# EAGLE design control_board (EAGLE 9.5.1)
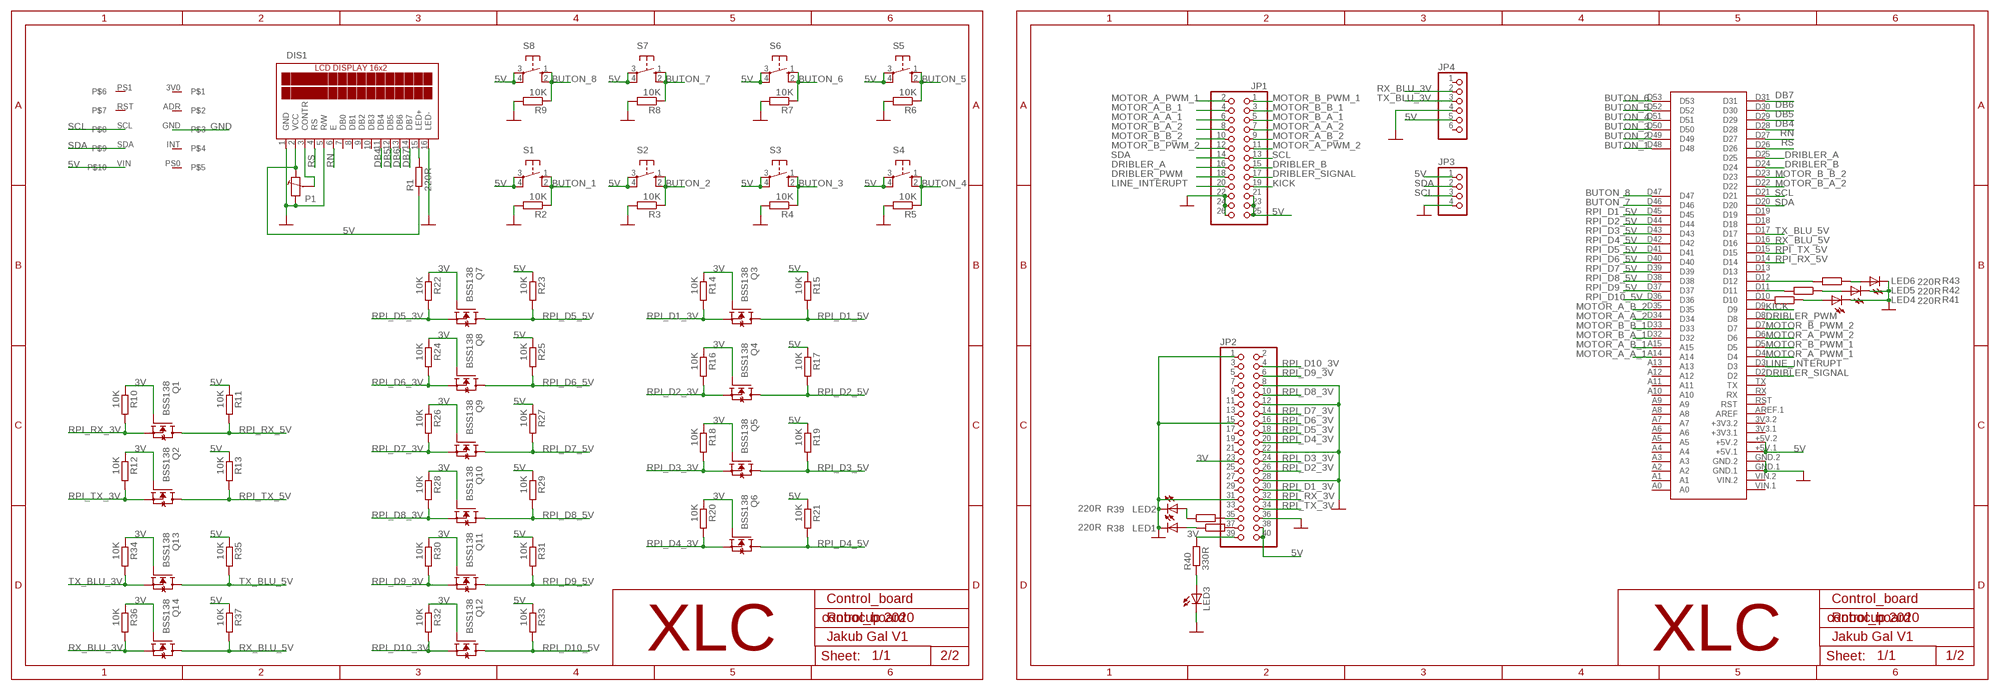
[diagram p0: schematic, sheet 1]

## Parts
DIS1  LCD_DISPLEJ_16X2Z  [LCD_DISPLEJ_16X2]
JP1  PINHD-2X13_2.54  [2X13]
JP2  PINHD-2X20_2.54  [2X20]
JP3  PINHD-1X4_2.54  [1X04]
JP4  PINHD-1X6_2.54  [1X06]
LED1  LEDCHIPLED_0603  [CHIPLED_0603]
LED2  LEDCHIPLED_0603  [CHIPLED_0603]
LED3  LEDCHIPLED_0603  [CHIPLED_0603]
LED4  LEDCHIPLED_0603  [CHIPLED_0603]
LED5  LEDCHIPLED_0603  [CHIPLED_0603]
LED6  LEDCHIPLED_0603  [CHIPLED_0603]
P1  TRIMER-CA6V  [TP-CA6V]
Q1  BSS138  [SOT23]
Q2  BSS138  [SOT23]
Q3  BSS138  [SOT23]
Q4  BSS138  [SOT23]
Q5  BSS138  [SOT23]
Q6  BSS138  [SOT23]
Q7  BSS138  [SOT23]
Q8  BSS138  [SOT23]
Q9  BSS138  [SOT23]
Q10  BSS138  [SOT23]
Q11  BSS138  [SOT23]
Q12  BSS138  [SOT23]
Q13  BSS138  [SOT23]
Q14  BSS138  [SOT23]
R1  220R  R-EU_R0603  [R0603]
R2  10K  R-EU_R0603  [R0603]
R3  10K  R-EU_R0603  [R0603]
R4  10K  R-EU_R0603  [R0603]
R5  10K  R-EU_R0603  [R0603]
R6  10K  R-EU_R0603  [R0603]
R7  10K  R-EU_R0603  [R0603]
R8  10K  R-EU_R0603  [R0603]
R9  10K  R-EU_R0603  [R0603]
R10  10K  R-EU_R0603  [R0603]
R11  10K  R-EU_R0603  [R0603]
R12  10K  R-EU_R0603  [R0603]
R13  10K  R-EU_R0603  [R0603]
R14  10K  R-EU_R0603  [R0603]
R15  10K  R-EU_R0603  [R0603]
R16  10K  R-EU_R0603  [R0603]
R17  10K  R-EU_R0603  [R0603]
R18  10K  R-EU_R0603  [R0603]
R19  10K  R-EU_R0603  [R0603]
R20  10K  R-EU_R0603  [R0603]
R21  10K  R-EU_R0603  [R0603]
R22  10K  R-EU_R0603  [R0603]
R23  10K  R-EU_R0603  [R0603]
R24  10K  R-EU_R0603  [R0603]
R25  10K  R-EU_R0603  [R0603]
R26  10K  R-EU_R0603  [R0603]
R27  10K  R-EU_R0603  [R0603]
R28  10K  R-EU_R0603  [R0603]
R29  10K  R-EU_R0603  [R0603]
R30  10K  R-EU_R0603  [R0603]
R31  10K  R-EU_R0603  [R0603]
R32  10K  R-EU_R0603  [R0603]
R33  10K  R-EU_R0603  [R0603]
R34  10K  R-EU_R0603  [R0603]
R35  10K  R-EU_R0603  [R0603]
R36  10K  R-EU_R0603  [R0603]
R37  10K  R-EU_R0603  [R0603]
R38  220R  R-EU_R0603  [R0603]
R39  220R  R-EU_R0603  [R0603]
R40  330R  R-EU_R0603  [R0603]
R41  220R  R-EU_R0603  [R0603]
R42  220R  R-EU_R0603  [R0603]
R43  220R  R-EU_R0603  [R0603]
S1  10-XX  [B3F-10XX]
S2  10-XX  [B3F-10XX]
S3  10-XX  [B3F-10XX]
S4  10-XX  [B3F-10XX]
S5  10-XX  [B3F-10XX]
S6  10-XX  [B3F-10XX]
S7  10-XX  [B3F-10XX]
S8  10-XX  [B3F-10XX]
U$1  MEGA2560_MIKRO  [MEGA2560_MIKRO]
U$2  BNO055  [BNO005]

## Nets
3V: JP2.23 JP2.39 Q1.1(G) Q2.1(G) Q3.1(G) Q4.1(G) Q5.1(G) Q6.1(G) Q7.1(G) Q8.1(G) Q9.1(G) Q10.1(G) Q11.1(G) Q12.1(G) Q13.1(G) Q14.1(G) R10.1 R12.1 R14.1 R16.1 R18.1 R20.1 R22.1 R24.1 R26.1 R28.1 R30.1 R32.1 R34.1 R36.1 R40.2
5V: DIS1.2(VCC) JP1.21 JP1.23 JP1.25 JP2.38 JP2.40 JP3.1 JP4.5 P1.2 R1.1 R11.1 R13.1 R15.1 R17.1 R19.1 R21.1 R23.1 R25.1 R27.1 R29.1 R31.1 R33.1 R35.1 R37.1 S1.3(P) S1.4(P1) S2.3(P) S2.4(P1) S3.3(P) S3.4(P1) S4.3(P) S4.4(P1) S5.3(P) S5.4(P1) S6.3(P) S6.4(P1) S7.3(P) S7.4(P1) S8.3(P) S8.4(P1) U$1.+5V.1 U$1.+5V.2 U$2.VIN
BUTON_1: R2.1 S1.1(S) S1.2(S1) U$1.D48
BUTON_2: R3.1 S2.1(S) S2.2(S1) U$1.D49
BUTON_3: R4.1 S3.1(S) S3.2(S1) U$1.D50
BUTON_4: R5.1 S4.1(S) S4.2(S1) U$1.D51
BUTON_5: R6.1 S5.1(S) S5.2(S1) U$1.D52
BUTON_6: R7.1 S6.1(S) S6.2(S1) U$1.D53
BUTON_7: R8.1 S7.1(S) S7.2(S1) U$1.D46
BUTON_8: R9.1 S8.1(S) S8.2(S1) U$1.D47
DB4: DIS1.11(DB4) U$1.D28
DB5: DIS1.12(DB5) U$1.D29
DB6: DIS1.13(DB6) U$1.D30
DB7: DIS1.14(DB7) U$1.D31
DRIBLER_A: JP1.16 U$1.D25
DRIBLER_B: JP1.15 U$1.D24
DRIBLER_PWM: JP1.18 U$1.D8
DRIBLER_SIGNAL: JP1.17 U$1.D2
GND: DIS1.1(GND) DIS1.5(R/W) DIS1.16(LED-) JP1.22 JP1.24 JP1.26 JP2.1 JP2.8 JP2.12 JP2.15 JP2.22 JP2.28 JP2.31 JP2.36 JP3.4 JP4.4 LED1.C LED2.C LED3.C LED4.C LED5.C LED6.C P1.1 R2.2 R3.2 R4.2 R5.2 R6.2 R7.2 R8.2 R9.2 U$1.GND.1 U$1.GND.2 U$2.GND
KICK: JP1.19 U$1.D9
LINE_INTERUPT: JP1.20 U$1.D3
MOTOR_A_A_1: JP1.6 U$1.A14
MOTOR_A_A_2: JP1.7 U$1.D34
MOTOR_A_B_1: JP1.4 U$1.A15
MOTOR_A_B_2: JP1.9 U$1.D35
MOTOR_A_PWM_1: JP1.2 U$1.D4
MOTOR_A_PWM_2: JP1.11 U$1.D6
MOTOR_B_A_1: JP1.5 U$1.D32
MOTOR_B_A_2: JP1.8 U$1.D22
MOTOR_B_B_1: JP1.3 U$1.D33
MOTOR_B_B_2: JP1.10 U$1.D23
MOTOR_B_PWM_1: JP1.1 U$1.D5
MOTOR_B_PWM_2: JP1.12 U$1.D7
N$1: JP2.37 R38.2
N$2: DIS1.15(LED+) R1.2
N$3: DIS1.3(CONTR) P1.BEZ
N$4: LED2.A R39.1
N$5: JP2.35 R39.2
N$6: LED3.A R40.1
N$7: LED4.A R41.1
N$8: R41.2 U$1.D10
N$9: LED5.A R42.1
N$10: R42.2 U$1.D11
N$11: LED6.A R43.1
N$12: R43.2 U$1.D12
N$20: LED1.A R38.1
RN: DIS1.6(E) U$1.D27
RPI_D1_3V: JP2.30 Q3.2(S) R14.2
RPI_D1_5V: Q3.3(D) R15.2 U$1.D45
RPI_D2_3V: JP2.26 Q4.2(S) R16.2
RPI_D2_5V: Q4.3(D) R17.2 U$1.D44
RPI_D3_3V: JP2.24 Q5.2(S) R18.2
RPI_D3_5V: Q5.3(D) R19.2 U$1.D43
RPI_D4_3V: JP2.20 Q6.2(S) R20.2
RPI_D4_5V: Q6.3(D) R21.2 U$1.D42
RPI_D5_3V: JP2.18 Q7.2(S) R22.2
RPI_D5_5V: Q7.3(D) R23.2 U$1.D41
RPI_D6_3V: JP2.16 Q8.2(S) R24.2
RPI_D6_5V: Q8.3(D) R25.2 U$1.D40
RPI_D7_3V: JP2.14 Q9.2(S) R26.2
RPI_D7_5V: Q9.3(D) R27.2 U$1.D39
RPI_D8_3V: JP2.10 Q10.2(S) R28.2
RPI_D8_5V: Q10.3(D) R29.2 U$1.D38
RPI_D9_3V: JP2.6 Q11.2(S) R30.2
RPI_D9_5V: Q11.3(D) R31.2 U$1.D37
RPI_D10_3V: JP2.4 Q12.2(S) R32.2
RPI_D10_5V: Q12.3(D) R33.2 U$1.D36
RPI_RX_3V: JP2.32 Q1.2(S) R10.2
RPI_RX_5V: Q1.3(D) R11.2 U$1.D14
RPI_TX_3V: JP2.34 Q2.2(S) R12.2
RPI_TX_5V: Q2.3(D) R13.2 U$1.D15
RS: DIS1.4(RS) U$1.D26
RX_BLU_3V: JP4.2 Q14.2(S) R36.2
RX_BLU_5V: Q14.3(D) R37.2 U$1.D16
SCL: JP1.13 JP3.3 U$1.D21 U$2.SCL
SDA: JP1.14 JP3.2 U$1.D20 U$2.SDA
TX_BLU_3V: JP4.3 Q13.2(S) R34.2
TX_BLU_5V: Q13.3(D) R35.2 U$1.D17
Unconnected: DIS1.7(DB0) DIS1.8(DB1) DIS1.9(DB2) DIS1.10(DB3) JP2.2 JP2.3 JP2.5 JP2.7 JP2.9 JP2.11 JP2.13 JP2.17 JP2.19 JP2.21 JP2.25 JP2.27 JP2.29 JP2.33 JP4.1 JP4.6 U$1.3V3.1(+3V3.1) U$1.3V3.2(+3V3.2) U$1.A0 U$1.A1 U$1.A2 U$1.A3 U$1.A4 U$1.A5 U$1.A6 U$1.A7 U$1.A8 U$1.A9 U$1.A10 U$1.A11 U$1.A12 U$1.A13 U$1.AREF.1(AREF) U$1.D13 U$1.D18 U$1.D19 U$1.RST U$1.RX U$1.TX U$1.VIN.1 U$1.VIN.2 U$2.3V0 U$2.ADR U$2.INT U$2.PS0 U$2.PS1 U$2.RST

## Notes on the sheet
- Control_board | Control_board
- Robocup 2020 | Robocup 2020
- Jakub Gal V1 | Jakub Gal V1
- XLC | XLC
- 2/2 | 1/2

## Library data of the parts
DIS1 = TABOR K1:LCD_DISPLEJ_16X2: LCD displej 16x2 s IO HD44870 : kolik= 0,6x0,6mm diera s pokovenim = 0,9mm vrtanie = 1,1mm
JP1 = pinhead-1:PINHD-2X13: PIN HEADER
JP2 = pinhead-1:PINHD-2X20: PIN HEADER
JP3 = pinhead-1:PINHD-1X4: PIN HEADER
JP4 = pinhead-1:PINHD-1X6: PIN HEADER
LED1-LED6 = audio amplifier example:LED
P1 = TABOR K1:TRIMER: Trimer
Q1-Q14 = bss138_10:BSS138: BSS138 N-Channel Logic Level Enhancement Mode Field Effect Transistor Source: http://www.fairchildsemi.com/datasheets/BS/BSS138.pdf; MF: Fairchild; MPN: BSS138; OC_FARNELL: 9845330; OC_NEWARK: 67R2009
R1-R43 = rcl:R-EU_: RESISTOR, European symbol; SPICEPREFIX: R
S1-S8 = switch-omron:10-XX: OMRON SWITCH; MPN: B3F-1000; OC_FARNELL: 176432; OC_NEWARK: 36M3542
U$1 = MIKRO_MEGA2560:MEGA2560_MIKRO: Arduino Mega2560 pro robotDyn, create by mikroavr.com
U$2 = SERVO:BNO055

## Board
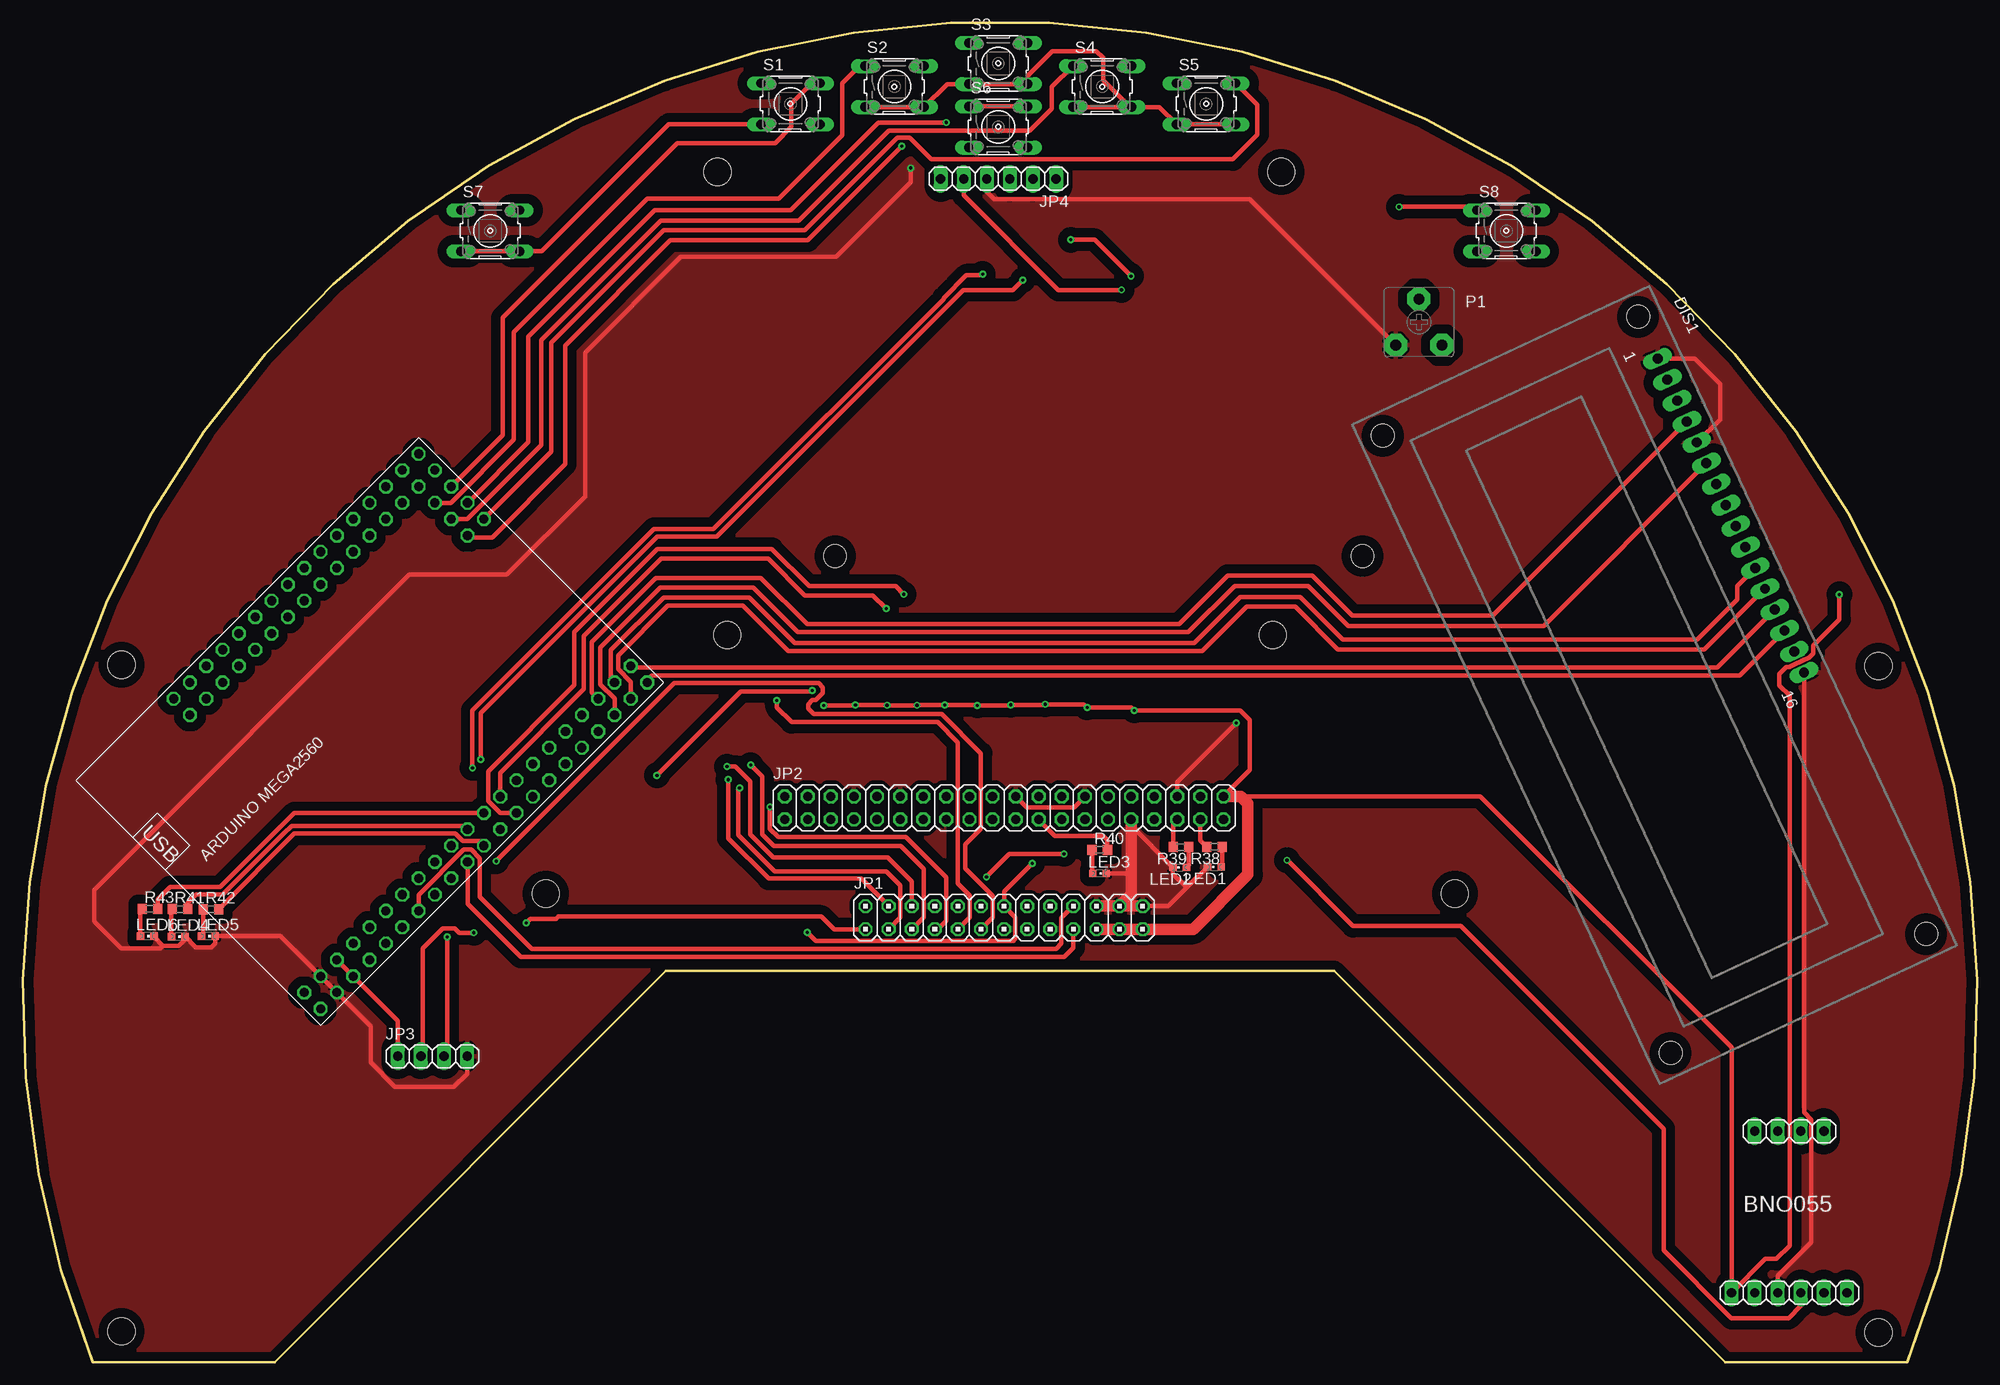
[diagram p1: board, top side]
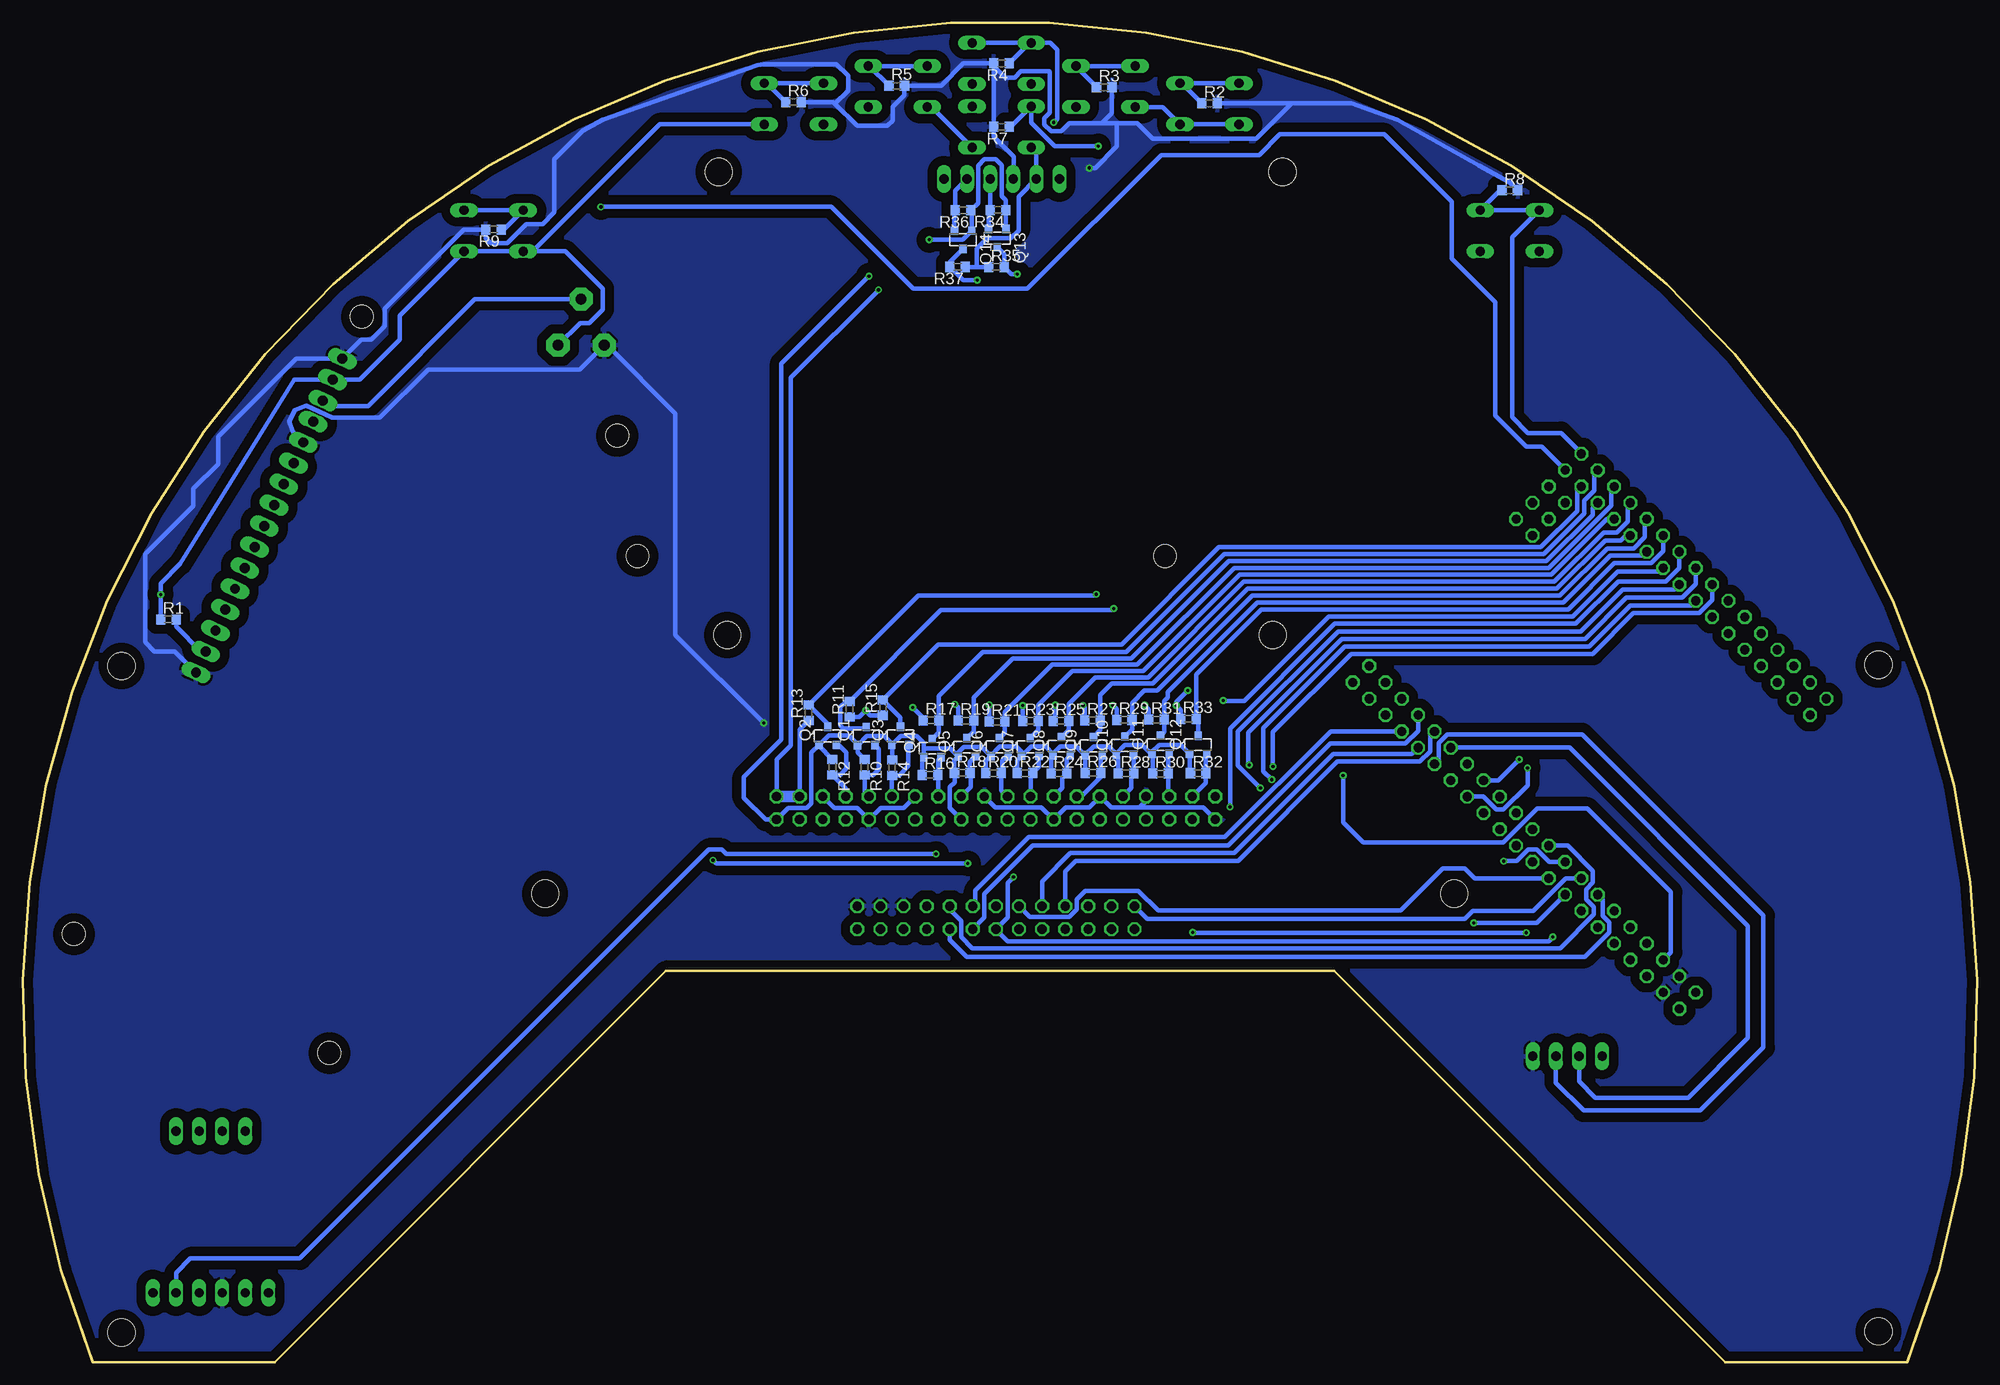
[diagram p2: board, bottom side, seen from below]

Size 214.96 x 147.35 mm. Coordinates in mm from the lower left corner, seen from the top.
Outline: 144.23,43.03 187.27,0 207.27,0 arc224 7.7,0 27.7,0 70.73,43.03 144.23,43.03
Copper layers (1*16): Top 0.035mm / dielectric 1.5mm / Bottom 0.035mm
Design rules "default": minimum track width 6mil, minimum drill 0.35mm, track to track 6mil, track to pad 6mil, pad to pad 6mil, via to via 6mil, smd to smd 6mil, copper to edge 40mil, drill to drill 6mil, minimum pad ring 10mil, minimum via ring 8mil, stop-mask expansion 4mil, vias tented up to drill 0mil, thermal gap 10mil
Holes 3 mm at 204.09,3.26 10.87,76.72 138.41,130.94 10.87,3.4 204.09,76.58 77.48,79.99 76.41,130.94 57.51,51.53 157.51,51.53 137.48,79.99
Holes 2.5 mm at 89.35,88.68 147.35,88.68

### Footprints (pad centres in the part's own frame; a part is rotated, then mirrored left to right if it is on the bottom)
LCD_DISPLEJ_16X2 = drill 1.092 pad 1.676 long: 1 -33.02,15.24; 2 -30.48,15.24; 3 -27.94,15.24; 4 -25.4,15.24; 5 -22.86,15.24; 6 -20.32,15.24; 7 -17.78,15.24; 8 -15.24,15.24; 9 -12.7,15.24; 10 -10.16,15.24; 11 -7.62,15.24; 12 -5.08,15.24; 13 -2.54,15.24; 14 0,15.24; 15 2.54,15.24; 16 5.08,15.24 | hole 2.54: -38.1,15.24; 36.83,15.24; 36.83,-15.748; -38.1,-15.748
2X13 = drill 1.016 octagon: 1 -15.24,-1.27; 2 -15.24,1.27; 3 -12.7,-1.27; 4 -12.7,1.27; 5 -10.16,-1.27; 6 -10.16,1.27; 7 -7.62,-1.27; 8 -7.62,1.27; 9 -5.08,-1.27; 10 -5.08,1.27; 11 -2.54,-1.27; 12 -2.54,1.27; 13 0,-1.27; 14 0,1.27; 15 2.54,-1.27; 16 2.54,1.27; 17 5.08,-1.27; 18 5.08,1.27; 19 7.62,-1.27; 20 7.62,1.27; 21 10.16,-1.27; 22 10.16,1.27; 23 12.7,-1.27; 24 12.7,1.27; 25 15.24,-1.27; 26 15.24,1.27
2X20 = drill 1.016 octagon: 1 -24.13,-1.27; 2 -24.13,1.27; 3 -21.59,-1.27; 4 -21.59,1.27; 5 -19.05,-1.27; 6 -19.05,1.27; 7 -16.51,-1.27; 8 -16.51,1.27; 9 -13.97,-1.27; 10 -13.97,1.27; 11 -11.43,-1.27; 12 -11.43,1.27; 13 -8.89,-1.27; 14 -8.89,1.27; 15 -6.35,-1.27; 16 -6.35,1.27; 17 -3.81,-1.27; 18 -3.81,1.27; 19 -1.27,-1.27; 20 -1.27,1.27; 21 1.27,-1.27; 22 1.27,1.27; 23 3.81,-1.27; 24 3.81,1.27; 25 6.35,-1.27; 26 6.35,1.27; 27 8.89,-1.27; 28 8.89,1.27; 29 11.43,-1.27; 30 11.43,1.27; 31 13.97,-1.27; 32 13.97,1.27; 33 16.51,-1.27; 34 16.51,1.27; 35 19.05,-1.27; 36 19.05,1.27; 37 21.59,-1.27; 38 21.59,1.27; 39 24.13,-1.27; 40 24.13,1.27
1X04 = drill 1.016 long: 1 -3.81,0; 2 -1.27,0; 3 1.27,0; 4 3.81,0
1X06 = drill 1.016 long: 1 -6.35,0; 2 -3.81,0; 3 -1.27,0; 4 1.27,0; 5 3.81,0; 6 6.35,0
CHIPLED_0603 = smd 0.8 x 0.8: A 0,-0.75; C 0,0.75
TP-CA6V = drill 1.194 pad 2.54 octagon: 1 -2.54,-2.54; 2 2.54,-2.54; BEZ 0,2.54
SOT23 = smd 0.8 x 0.9: 1 -0.95,-1; 2 0.95,-1; 3 0,1
R0603 = smd 1 x 1.1: 1 -0.85,0; 2 0.85,0
B3F-10XX = drill 1.016 long: 1 -3.251,2.261; 2 3.251,2.261; 3 -3.251,-2.261; 4 3.251,-2.261
MEGA2560_MIKRO = drill 1 octagon: 3V3.1 -26.67,-17.78; 3V3.2 -26.67,-20.32; +5V.1 -29.21,-17.78; +5V.2 -29.21,-20.32; A0 -21.59,15.24; A1 -21.59,12.7; A2 -19.05,15.24; A3 -19.05,12.7; A4 -16.51,15.24; A5 -16.51,12.7; A6 -13.97,15.24; A7 -13.97,12.7; A8 -11.43,15.24; A9 -11.43,12.7; A10 -8.89,15.24; A11 -8.89,12.7; A12 -6.35,15.24; A13 -6.35,12.7; A14 -3.81,15.24; A15 -3.81,12.7; AREF.1 -24.13,-17.78; D2 -19.05,-17.78; D3 -19.05,-20.32; D4 -16.51,-17.78; D5 -16.51,-20.32; D6 -13.97,-17.78; D7 -13.97,-20.32; D8 -11.43,-17.78; D9 -11.43,-20.32; D10 -8.89,-17.78; D11 -8.89,-20.32; D12 -6.35,-17.78; D13 -6.35,-20.32; D14 -3.81,-17.78; D15 -3.81,-20.32; D16 -1.27,-17.78; D17 -1.27,-20.32; D18 1.27,-17.78; D19 1.27,-20.32; D20 3.81,-17.78; D21 3.81,-20.32; D22 6.35,-17.78; D23 6.35,-20.32; D24 8.89,-17.78; D25 8.89,-20.32; D26 11.43,-17.78; D27 11.43,-20.32; D28 13.97,-17.78; D29 13.97,-20.32; D30 16.51,-17.78; D31 16.51,-20.32; D32 -1.27,15.24; D33 -1.27,12.7; D34 1.27,15.24; D35 1.27,12.7; D36 3.81,15.24; D37 3.81,12.7; D38 6.35,15.24; D39 6.35,12.7; D40 8.89,15.24; D41 8.89,12.7; D42 11.43,15.24; D43 11.43,12.7; D44 13.97,15.24; D45 13.97,12.7; D46 16.51,15.24; D47 16.51,12.7; D48 16.51,10.16; D49 13.97,10.16; D50 16.51,7.62; D51 13.97,7.62; D52 16.51,5.08; D53 13.97,5.08; GND.1 -31.75,-17.78; GND.2 -31.75,-20.32; RST -24.13,-20.32; RX -21.59,-17.78; TX -21.59,-20.32; VIN.1 -34.29,-17.78; VIN.2 -34.29,-20.32
BNO005 = drill 1.016 long: 3V0 -3.81,-17.78; ADR 3.81,0; GND -1.27,-17.78; INT 1.27,0; PS0 -3.81,0; PS1 -1.27,0; RST 6.35,-17.78; SCL 3.81,-17.78; SDA 1.27,-17.78; VIN -6.35,-17.78

### Placement (x,y rotation side)
DIS1  179.95,74.03 295 top
JP1  107.93,48.9 0 top
JP2  107.93,60.96 0 top
JP3  45.07,33.66 0 top
JP4  107.3,130.18 180 top
LED1  131.06,54.48 90 top
LED2  127.25,54.42 90 top
LED3  118.43,53.77 270 top
LED4  17.11,46.81 270 top
LED5  20.42,46.86 270 top
LED6  13.7,46.87 270 top
P1  153.56,114.41 0 top
Q1  122.19,68.86 0 bottom
Q2  126.44,68.89 0 bottom
Q3  118.44,68.89 0 bottom
Q4  114.93,67.54 0 bottom
Q5  111.13,67.64 0 bottom
Q6  107.53,67.66 0 bottom
Q7  104.16,67.67 0 bottom
Q8  100.71,67.76 0 bottom
Q9  97.2,67.77 0 bottom
Q10  93.76,67.82 0 bottom
Q11  89.83,67.92 0 bottom
Q12  85.69,67.91 0 bottom
Q13  107.78,123.66 180 bottom
Q14  111.54,123.47 180 bottom
R1  198.95,81.7 0 bottom
R2  84.44,138.47 0 bottom
R3  96.02,140.25 0 bottom
R4  107.3,142.88 180 bottom
R5  118.84,140.42 0 bottom
R6  130.21,138.62 0 bottom
R7  107.3,135.89 180 bottom
R8  51.42,128.91 0 bottom
R9  163.18,124.61 180 bottom
R10  122.38,65.45 270 bottom
R11  124.02,71.83 90 bottom
R12  125.91,65.44 270 bottom
R13  128.54,71.43 90 bottom
R14  119.36,65.4 270 bottom
R15  120.36,72.01 90 bottom
R16  115.19,64.61 0 bottom
R17  115.07,70.61 0 bottom
R18  111.63,64.81 0 bottom
R19  111.23,70.58 0 bottom
R20  108.18,64.8 0 bottom
R21  107.82,70.47 0 bottom
R22  104.72,64.8 0 bottom
R23  104.14,70.55 0 bottom
R24  100.99,64.77 0 bottom
R25  100.79,70.55 0 bottom
R26  97.27,64.83 0 bottom
R27  97.29,70.61 0 bottom
R28  93.61,64.77 0 bottom
R29  93.81,70.67 0 bottom
R30  89.82,64.75 0 bottom
R31  90.25,70.69 0 bottom
R32  85.68,64.78 0 bottom
R33  86.76,70.77 0 bottom
R34  107.7,126.75 180 bottom
R35  107.88,120.47 0 bottom
R36  111.54,126.71 180 bottom
R37  112.14,120.49 180 bottom
R38  131.06,56.68 180 top
R39  127.37,56.67 180 top
R40  118.45,56.35 0 top
R41  17.3,49.83 0 top
R42  20.7,49.82 0 top
R43  13.98,49.87 0 top
S1  84.44,138.43 0 top
S2  95.87,140.34 0 top
S3  107.3,142.88 0 top
S4  118.73,140.34 0 top
S5  130.16,138.43 0 top
S6  107.3,135.89 0 top
S7  51.42,124.46 0 top
S8  163.18,124.46 0 top
U$1  42.63,77.47 45 top
U$2  194.29,25.4 0 top

### Tracks (layer width: path | path; a pad name or v marks a point on that pad's centre or on a via)
3V  (via drill 0.35)
  Top 0.508: R40.2 119.3,57.43 118.86,57.87 113.52,57.87 111.74,59.65 JP2.23 | v121.89,119.49 117.91,123.47 v115.26,123.47
  Bottom 0.508: R10.1 123.14,67.06 Q1.1 123.09,67.92 | R14.1 119.36,67.86 Q3.1 | Q3.1 119.39,68.05 120.22,68.88 122.13,68.88 123.09,67.92 | R12.1 127.39,67.77 Q2.1 | Q2.1 126.34,68.94 124.11,68.94 123.09,67.92 | Q2.1 128.23,67.05 128.23,61.48 128.73,60.98 130.77,60.98 JP2.39 133.25,59.69 135.65,62.09 135.65,64.36 131.53,68.48 131.53,109.85 v121.89,119.49 | 115.88,67.52 Q4.1 116.04,66.38 R16.1 | 115.88,67.52 115.88,68.12 116.66,68.9 118.38,68.9 Q3.1 | Q5.1 112.51,66.21 112.51,64.84 R18.1 112.48,63.79 113.02,63.25 113.02,60.97 JP2.23 | Q5.1 112.96,67.52 115.88,67.52 | R20.1 109.03,66.11 Q6.1 108.5,66.69 | 108.5,66.69 109.49,67.67 111.45,67.67 112.08,67.05 Q5.1 | Q7.1 105.11,67.11 105.71,67.71 107.48,67.71 108.5,66.69 | Q7.1 105.57,66.2 R22.1 | 101.66,66.92 Q8.1 101.84,66.58 R24.1 | 101.66,66.92 102.46,67.72 104.06,67.72 Q7.1 | Q9.1 98.12,66.75 R26.1 | Q9.1 99.1,67.72 100.85,67.72 101.66,66.92 | R28.1 94.46,66.58 Q10.1 94.71,66.92 | 94.71,66.92 95.52,67.73 97.19,67.73 Q9.1 | R30.1 90.67,66.81 Q11.1 90.85,66.92 | 90.85,66.92 91.81,67.88 93.74,67.88 94.71,66.92 | 90.85,66.92 90.85,67.04 89.99,67.9 87.63,67.9 Q12.1 86.64,64.89 R32.1 | Q13.1 106.85,124.67 R34.1 106.85,127.81 107.3,128.26 107.3,131.69 107.93,132.32 109.22,132.32 109.89,131.65 109.89,127.5 R36.1 | R36.1 110.59,126.61 Q14.1 111.6,123.47 v115.26,123.47 | R36.1
5V  (via drill 0.35)
  Top 0.508: v88.1,72.24 91.54,72.24 v91.58,72.28 95.04,72.28 v95.06,72.26 v98.35,72.26 98.37,72.28 v101.39,72.28 104.96,72.28 v104.99,72.25 108.6,72.25 v108.66,72.31 112.38,72.31 v112.44,72.37 116.7,72.37 v117.06,72.01 121.93,72.01 v122.26,71.68 133.91,71.68 134.97,70.62 134.97,65.14 JP2.40 160.31,62.23 187.94,34.6 U$2.VIN 191.66,11.34 192.86,11.34 194.31,12.79 194.31,73.33 193.18,74.46 193.18,75.72 193.93,76.47 194.16,76.47 194.18,76.49 194.3,76.49 194.81,76.73 196.48,77.51 196.94,77.97 196.94,78.86 199.8,81.72 v199.8,84.46 | S2.3 S2.4 101.66,140.61 S3.3 S3.4 110.55,141.55 113.24,144.24 118.08,144.24 118.82,143.5 118.82,141.04 121.79,138.07 S4.4 | S4.3 S4.4 | S4.4 125,138.07 S5.3 S5.4 | S7.3 S7.4 57.1,122.2 71.07,136.17 S1.3 | U$1.+5V.1 U$1.+5V.2 41.26,37.54 JP3.1 | v120.84,117.96 113.9,117.96 103.49,128.38 JP4.5 | v69.75,64.55 78.97,73.77 86.71,73.77 v86.82,73.88
  Top 1.27: JP1.21 JP1.23 JP1.25 128.73,47.62 134.73,53.63 134.73,61.47 133.97,62.23 JP2.40
  Bottom 0.508: R13.1 129.52,69.59 JP2.38 | 123.99,71.02 R11.1 122.96,70.98 v122.26,71.68 121.74,71.16 R15.1 120.49,71.03 | R17.1 115.92,70.87 v117.06,72.01 | R19.1 112.08,72.01 v112.44,72.37 | v108.66,72.31 v108.67,72.3 R21.1 | R23.1 v104.99,72.25 | R25.1 101.39,70.8 v101.39,72.28 | R27.1 98.14,72.05 v98.35,72.26 | R29.1 94.66,71.86 v95.06,72.26 | R31.1 91.1,71.8 v91.58,72.28 | R33.1 87.61,71.75 v88.1,72.24 88.1,72.6 v86.82,73.88 | R37.1 111.27,120.47 110.03,120.47 | 110.03,120.47 R35.1 | S6.3 103.49,133.07 JP4.5 105.44,128.22 105.44,124.5 106.28,123.66 108.88,123.66 110.03,122.51 110.03,120.47 | S6.4 114.99,138.07 S4.3 | S1.3 S1.4 89.59,138.07 S2.3 | S5.4 144.91,136.17 158.88,122.2 S8.3 | S8.3 S8.4 173.48,115.15 173.48,112.5 177.88,108.1 DIS1.2 185.12,108.1 197.62,87.83 199.8,85.65 v199.8,84.46 R1.1 | P1.2 153.67,114.3 152.68,114.3 151.18,115.8 151.18,118.1 155.28,122.2 S8.3 | JP2.40 132.06,66.29 130.49,67.86 130.49,108.31 v120.84,117.96 | U$1.+5V.1 33.7,45.09 33.7,51.7 42.89,60.89 48.41,60.89 52.15,57.15 67.54,57.15 69.75,59.36 v69.75,64.55
  Bottom 1.27: JP2.38 JP2.40
BUTON_1
  Top 0.508: U$1.D48 52.78,101.98 52.78,114.9 72,134.12 82.77,134.12 84.54,135.89 84.54,138.45 86.78,140.69 S1.2
  Bottom 0.508: S1.1 S1.2 87.5,140.69 R2.1
BUTON_2
  Top 0.508: U$1.D49 47.05,94.53 54.01,101.49 54.01,113.3 68.71,128 83.13,128 90.12,134.99 90.12,140.7 92.02,142.6 S2.1
  Bottom 0.508: R3.1 99.12,142.5 S2.2 S2.1
BUTON_3  (via drill 0.35)
  Top 0.508: U$1.D50 55.58,101.19 55.58,112.83 69.49,126.74 84.45,126.74 94.07,136.36 101.54,136.36 v101.56,136.38
  Bottom 0.508: S3.1 S3.2 | R4.1 104.18,145.14 S3.1 | S3.1 101.95,145.14 101.17,144.36 101.17,136.77 v101.56,136.38
BUTON_4
  Top 0.508: U$1.D51 48.89,92.74 57.01,100.86 57.01,112.42 70.16,125.57 85.34,125.57 95.22,135.45 110.75,135.45 113.19,137.89 113.19,140.31 S4.1
  Bottom 0.508: S4.1 S4.2 121.86,142.6 R5.1
BUTON_5
  Top 0.508: S5.2 135.78,138.32 135.78,135.04 133.08,132.34 99.92,132.34 97.58,134.69 96.16,134.69 93.81,132.34 93.8,132.34 86.01,124.55 70.52,124.55 58.14,112.17 58.14,100.16 U$1.D52
  Bottom 0.508: S5.1 S5.2 133.12,140.69 R6.1
BUTON_6  (via drill 0.35)
  Top 0.508: S6.1 S6.2 | U$1.D53 49.12,90.74 51.62,90.74 59.66,98.78 59.66,111.85 71.24,123.43 86.34,123.43 v96.68,133.77
  Bottom 0.508: R7.1 106.3,135.89 S6.1 104.04,136.36 101.45,133.77 v96.68,133.77
BUTON_7
  Bottom 0.508: R8.1 52.48,128.91 S7.2 S7.1 48.2,126.72 51.17,123.75 51.17,103.97 49.43,102.23 45.76,102.23 43.53,100 U$1.D46
BUTON_8  (via drill 0.35)
  Top 0.508: v151.37,127.09 159.55,127.09 S8.1
  Bottom 0.508: R9.1 162.04,124.61 S8.1 S8.2 | v151.37,127.09 126.05,127.09 117.04,118.08 104.47,118.08 89.76,132.79 78.99,132.79 76.71,135.07 65.2,135.07 57.81,127.68 57.81,121.4 53.03,116.62 53.03,104.11 49.63,100.71 47.91,100.71 U$1.D47
DB4
  Top 0.508: U$1.D28 64.69,75.17 64.69,78.32 70.49,84.12 79.9,84.12 84.92,79.1 128.84,79.1 133.92,84.18 140.49,84.18 145.15,79.52 184.16,79.52 188.55,83.91 188.55,85.39 DIS1.11
DB5
  Top 0.508: DIS1.12 184.95,78.41 144.65,78.41 139.95,83.11 134.6,83.11 129.72,78.23 84.21,78.23 79.19,83.25 70.96,83.25 65.47,77.76 65.47,76.25 66.88,74.84 U$1.D29
DB6
  Top 0.508: DIS1.13 186.35,76.44 67.31,76.44 67.18,76.57 U$1.D30
DB7
  Top 0.508: DIS1.14 188.82,75.54 87.9,75.54 87.9,75.53 69.18,75.53 68.68,75.03 U$1.D31
DRIBLER_A
  Bottom 0.508: U$1.D25 71.11,69.39 82.75,57.75 104.31,57.75 110.19,51.87 110.19,50.45 JP1.16
DRIBLER_B
  Bottom 0.508: U$1.D24 61.49,69.43 62.89,68.03 71.18,68.03 82.38,56.83 103.9,56.83 109.2,51.53 109.2,48.9 JP1.15
DRIBLER_PWM
  Bottom 0.508: JP1.18 113.01,49.82 111.75,48.56 111.75,46.75 110.53,45.53 45.89,45.53 42.16,49.26 42.16,50.05 43.01,50.9 43.01,52.01 42.27,52.75 42.27,54.04 45.05,56.81 U$1.D8
DRIBLER_SIGNAL
  Bottom 0.508: JP1.17 113.01,46.47 111.13,44.59 43.19,44.59 40.49,47.29 40.49,48.36 41.2,49.07 41.2,50.89 U$1.D2
GND  (via drill 0.35)
  Top 0.508: JP2.22 110.4,61.03 115.62,61.03 JP2.28 | DIS1.1 183.88,110.4 186.68,107.6 186.68,103.7 184.17,101.19 DIS1.5 | LED1.C 128.02,52.2 | 128.02,52.2 125.99,50.16 JP1.26 | 128.02,52.2 126.5,53.73 LED2.C 121.9,59.02 JP2.31 121.9,59.46 | LED3.C 121.31,53.77 121.9,53.18 | LED6.C 14.45,46.77 15.4,45.81 | 15.4,45.81 17.15,45.81 17.86,46.52 LED4.C 18.98,45.69 18.98,45.61 20.71,45.61 21.17,46.06 LED5.C 28.34,46.86 U$1.GND.1 U$1.GND.2 38.25,36.95 38.25,32.98 40.94,30.29 47.43,30.29 48.88,31.73 JP3.4 | P1.1 134.93,127.96 106.83,127.96 106.03,128.76 JP4.4 | DIS1.16 195.91,27.47 196.73,26.65 196.73,13.19 193.02,9.48 U$2.GND | JP2.36 126.98,63.8 v133.48,70.3 | 15.4,45.81 15.1,45.51 10.82,45.51 7.86,48.47 7.86,51.97 42.51,86.62 53.25,86.62 61.84,95.21 61.84,111.07 72.36,121.59 89.45,121.59 97.65,129.79 v97.65,131.37
  Top 1.27: JP2.31 121.9,53.18 121.9,51.44 JP1.24 | JP1.22 JP1.24 | JP1.24 JP1.26
  Bottom 0.508: JP2.36 125.73,60.98 123.19,60.98 JP2.31 120.61,60.98 118.07,60.98 JP2.28 | JP2.22 108,61.03 102.92,61.03 JP2.15 100.27,61 97.64,61 96.5,62.14 JP2.12 95.27,61 92.15,61 | 92.15,61 91.42,61.73 JP2.8 | 92.15,61 85.11,61 JP2.1 | 105.95,129.67 105.95,132.63 108.15,134.82 R7.2 R4.2 | R4.2 111.51,142.88 113.96,140.42 R5.2 117.99,139.4 119.28,138.1 119.28,136.6 119.88,136 123.18,136 125.63,138.45 | R4.2 108.15,142.56 106.88,141.3 105.88,141.3 105.18,142 102.09,142 102,141.91 102,137.44 102.61,136.84 102.61,136.15 101.86,135.41 100.74,135.41 99.84,136.3 96.28,136.3 | R3.2 95.17,137.41 96.28,136.3 | R6.2 125.81,138.62 125.63,138.45 | R8.2 51.45,129.79 54.77,131.64 | 54.77,131.64 | 54.77,131.64 63.8,136.68 68.87,138.47 75.41,138.47 | 75.41,138.47 R2.2 | 96.28,136.3 94.62,136.3 | 94.62,136.3 92.38,136.3 90.68,134.6 79.28,134.6 75.41,138.47 | 125.63,138.45 124.18,139.9 124.18,141.5 125.48,142.8 133.46,142.8 134.2,142.67 151.16,136.68 153.36,135.46 156.48,132.34 156.48,126.5 157.78,125.2 159.58,125.2 161.68,123.1 163.48,123.1 164.03,123.64 R9.2 166.44,124.61 175.12,115.92 175.12,113.95 176.61,112.46 177.74,112.46 DIS1.1 184.88,110.4 193.48,101.8 193.48,98.8 196.18,96.1 196.18,94.2 201.48,88.9 201.48,79.2 200.48,78.2 198.24,78.2 DIS1.16 | DIS1.5 185.28,102.37 185.67,103.45 185.06,104.76 183.75,105.23 180.89,103.9 175.68,103.9 170.38,109.2 153.69,109.2 P1.1 150.67,111.87 143.17,104.37 143.17,79.99 v133.48,70.3 | v97.65,131.37 97.03,131.37 94.62,133.78 94.62,136.3
  pour Bottom (isolate 1.016): -5.02,-8 222.98,-8 222.98,151 -5.02,151
  pour Top (isolate 1.016): -7.02,-9 223.98,-9 223.98,152 -7.02,152
KICK
  Top 0.508: JP1.19 115.55,45.59 114.54,44.58 54.75,44.58 48.92,50.41 U$1.D9
LINE_INTERUPT
  Top 0.508: JP1.20 114.24,48.85 114.24,46.04 113.67,45.47 55.99,45.47 50.29,51.17 50.29,55.43 49.32,56.4 48.51,56.4 43.53,51.42 U$1.D3
MOTOR_A_A_1  (via drill 0.35)
  Top 0.508: v77.46,65.51 78.39,65.51 80.03,63.88 80.03,58.05 82.56,55.51 95.15,55.51 97.77,52.89 JP1.6
  Bottom 0.508: U$1.A14 29.16,83.82 30.59,82.39 37.81,82.39 42.28,77.92 68.84,77.92 77.46,69.3 v77.46,65.51
MOTOR_A_A_2  (via drill 0.35)
  Top 0.508: v82.18,61.07 82.18,58.68 83.07,57.79 97.09,57.79 101.58,53.3 101.58,48.56 100.65,47.62 JP1.7
  Bottom 0.508: U$1.D34 32.76,87.37 34.24,85.89 39.49,85.89 44.14,81.24 70.66,81.24 82.18,69.72 v82.18,61.07
MOTOR_A_B_1  (via drill 0.35)
  Top 0.508: v77.61,64.08 77.61,57.61 82.03,53.19 92.21,53.19 JP1.4
  Bottom 0.508: U$1.A15 31.46,83.26 38.15,83.26 42.7,78.71 69.56,78.71 78.51,69.76 78.51,64.98 v77.61,64.08
MOTOR_A_B_2  (via drill 0.35)
  Top 0.508: JP1.9 104.16,48.94 104.16,51.35 102.84,52.67 102.84,68.18 100.61,70.41 84.57,70.41 82.94,72.04 v82.94,72.78
  Bottom 0.508: U$1.D35 34.9,87 39.54,87 44.51,82.03 71.35,82.03 80.64,72.74 82.9,72.74 v82.94,72.78
MOTOR_A_PWM_1
  Bottom 0.508: U$1.D4 45.27,53.22 48.83,49.66 55.46,49.66 56.36,48.76 91.28,48.76 JP1.2
MOTOR_A_PWM_2  (via drill 0.35)
  Top 0.508: JP1.11 106.69,48.92 106.69,51.29 103.68,54.3 103.68,56.97 105.39,58.68 105.39,66.97 101.08,71.28 87,71.28 86.37,71.91 86.37,72.36 86.85,72.84 87.19,72.84 87.99,73.64 87.99,74.22 87.53,74.69 71.66,74.69 v52.08,55.11
  Bottom 0.508: v52.08,55.11 50.63,55.11 49.36,56.38 48.45,56.38 47.09,55.02 U$1.D6
MOTOR_B_A_1  (via drill 0.35)
  Top 0.508: v80.05,65.68 81.32,64.41 81.32,58.04 82.6,56.76 96.57,56.76 99.07,54.26 99.07,48.92 JP1.5
  Bottom 0.508: U$1.D32 30.96,85.62 32.47,84.11 38.59,84.11 43.14,79.56 69.9,79.56 80.17,69.29 80.17,65.8 v80.05,65.68
MOTOR_B_A_2
  Bottom 0.508: U$1.D22 60.16,68.92 60.16,67.18 61.29,66.05 70.39,66.05 81.3,55.14 99.17,55.14 100.31,54 JP1.8
MOTOR_B_B_1  (via drill 0.35)
  Top 0.508: v78.84,63.16 78.68,63 78.68,58 82.69,53.99 94.95,53.99 96.51,52.43 96.51,48.91 JP1.3
  Bottom 0.508: U$1.D33 33.29,85.02 38.98,85.02 43.61,80.39 70.3,80.39 81.33,69.36 81.33,65.65 v78.84,63.16
MOTOR_B_B_2
  Bottom 0.508: U$1.D23 62.19,66.89 62.19,66.88 70.84,66.88 81.72,56 99.73,56 102.85,52.88 JP1.10
MOTOR_B_PWM_1  (via drill 0.35)
  Top 0.508: JP1.1 89.24,47.62 87.84,49.02 58.92,49.02 58.66,48.76 55.81,48.76 v55.36,48.3
  Bottom 0.508: v55.36,48.3 48.45,48.3 U$1.D5
MOTOR_B_PWM_2
  Bottom 0.508: U$1.D7 55.28,53.22 56.36,54.3 58.8,54.3 63.43,49.67 90.07,49.67 92.25,51.85 98.11,51.85 99.04,50.92 99.04,49.78 99.86,48.96 104.19,48.96 JP1.12
N$1
  Top 0.508: JP2.37 129.52,57.37 R38.2
N$2
  Bottom 0.508: R1.2 198.1,80.9 195.37,78.17 DIS1.15
N$3
  Bottom 0.508: P1.BEZ 165.23,116.95 176.98,105.2 181.36,105.2 DIS1.3
N$4
  Top 0.508: R39.1 128.22,54.65 LED2.A
N$5
  Top 0.508: JP2.35 126.52,59.23 R39.2
N$6
  Top 0.508: R40.1 117.6,53.84 LED3.A
N$7
  Top 0.508: 16.47,49.81 R41.1 16.36,49.73 LED4.A
N$8
  Top 0.508: U$1.D10 48.52,59.01 29.56,59.01 28.7,58.15 28.47,57.92 22.01,51.46 19.07,51.46 18.15,50.54 R41.2
N$9
  Top 0.508: R42.1 19.85,47.05 LED5.A
N$10
  Top 0.508: R42.2 29.87,58.14 47.56,58.14 48.38,57.32 50.21,57.32 U$1.D11
N$11
  Top 0.508: 12.92,46.9 LED6.A 12.95,49.69 R43.1
N$12
  Top 0.508: R43.2 14.83,50.88 16.22,52.27 21.74,52.27 29.88,60.41 U$1.D12
N$20
  Top 0.508: R38.1 131.91,54.59 LED1.A
RN
  Top 0.508: DIS1.6 167.28,81 145.77,81 141.37,85.4 133.28,85.4 128.19,80.31 85.23,80.31 80.32,85.22 70.13,85.22 63.54,78.63 63.54,74.56 65.09,73.02 U$1.D27
RPI_D1_3V
  Bottom 0.508: Q3.2 117.55,67.83 117.55,65.57 118.57,64.55 R14.2 JP2.30
RPI_D1_5V
  Bottom 0.508: Q3.3 118.44,70.94 R15.2 114.26,78.96 94.09,78.96 83.4,89.65 47.99,89.65 44.01,93.63 44.01,95.85 U$1.D45
RPI_D2_3V
  Bottom 0.508: JP2.26 114.28,64.56 | 114.28,64.56 R16.2 | Q4.2 114.28,66.23 114.28,64.56
RPI_D2_5V
  Bottom 0.508: Q4.3 114.21,69.25 114.21,70.59 R17.2 114.22,73.27 109.35,78.14 93.6,78.14 82.84,88.9 47.69,88.9 43.25,93.34 43.25,94.77 42.13,95.89 42.13,97.73 U$1.D44
RPI_D3_3V
  Bottom 0.508: Q5.2 110.8,66.02 110.8,64.83 R18.2 110.69,64.72 110.69,63.28 JP2.24
RPI_D3_5V
  Bottom 0.508: Q5.3 110.38,69.39 R19.2 110.38,73.1 106.06,77.42 93.02,77.42 82.32,88.12 47.39,88.12 42.3,93.21 42.3,93.97 U$1.D43
RPI_D4_3V
  Bottom 0.508: JP2.20 107.33,62.9 R20.2 107.26,64.86 107.26,66.17 106.77,66.66 Q6.2
RPI_D4_5V
  Bottom 0.508: Q6.3 106.97,69.22 R21.2 106.97,71.52 101.76,76.73 92.36,76.73 81.73,87.36 47.15,87.36 40.27,94.24 40.27,96 U$1.D42
RPI_D5_3V
  Bottom 0.508: Q7.2 103.21,65.46 R22.2 104.12,64.55 JP2.18
RPI_D5_5V
  Bottom 0.508: Q7.3 103.29,69.53 R23.2 103.29,72.28 99.55,76.02 91.7,76.02 81.1,86.62 46.85,86.62 40.73,92.74 U$1.D41
RPI_D6_3V
  Bottom 0.508: Q8.2 100.14,66.38 R24.2 100.64,64.27 100.64,63.17 JP2.16
RPI_D6_5V
  Bottom 0.508: Q8.3 99.94,69.53 R25.2 99.94,72.42 97.03,75.33 91.19,75.33 80.66,85.86 46.5,85.86 41.08,91.28 39.67,91.28 38.45,92.5 38.45,94.23 U$1.D40
RPI_D7_3V
  Bottom 0.508: JP2.14 98.56,62.23 96.42,64.37 R26.2 96.42,66.59 Q9.2
RPI_D7_5V
  Bottom 0.508: Q9.3 96.44,69.53 R27.2 96.44,73.38 95.19,74.63 90.69,74.63 80.24,85.08 46.23,85.08 40.94,90.37 39.22,90.37 38.65,90.94 U$1.D39
RPI_D8_3V
  Bottom 0.508: JP2.10 93.05,63.14 93.05,64.47 R28.2 92.76,66.78 Q10.2
RPI_D8_5V
  Bottom 0.508: Q10.3 92.96,69.61 R29.2 92.96,72.51 91.59,73.88 90.16,73.88 79.73,84.31 45.91,84.31 40.69,89.53 37.79,89.53 36.56,90.76 36.56,92.52 U$1.D38
RPI_D9_3V
  Bottom 0.508: Q11.2 88.97,66.83 R30.2 88.97,62.32 JP2.6
RPI_D9_5V
  Bottom 0.508: Q11.3 89.4,69.34 R31.2 89.4,72.75 89.03,73.12 89.03,73.73 79.21,83.55 45.51,83.55 40.35,88.71 36.78,88.71 U$1.D37
RPI_D10_3V
  Bottom 0.508: Q12.2 84.83,66.81 R32.2 84.83,63.74 JP2.4
RPI_D10_5V
  Bottom 0.508: Q12.3 85.69,70.54 R33.2 85.91,75.66 78.76,82.81 45,82.81 39.9,87.91 35.85,87.91 34.55,89.21 U$1.D36
RPI_RX_3V
  Bottom 0.508: JP2.32 122.38,62.71 R10.2 121.43,64.6 120.81,65.22 120.81,67.44 Q1.2
RPI_RX_5V  (via drill 0.35)
  Top 0.508: v94.97,82.9 93.51,84.36 86.02,84.36 81.97,88.42 70.25,88.42 61.72,79.89 61.72,74.03 52.51,64.83 U$1.D14
  Bottom 0.508: Q1.3 122.37,69.69 124.72,69.69 125.04,70.01 125.04,72.05 124.41,72.69 R11.2 113.97,82.73 95.14,82.73 v94.97,82.9
RPI_TX_3V
  Bottom 0.508: JP2.34 124.44,63.12 R12.2 125.07,64.59 124.38,65.28 124.38,67.05 125.22,67.89 Q2.2
RPI_TX_5V  (via drill 0.35)
  Top 0.508: v96.9,84.47 96.01,85.36 86.51,85.36 82.4,89.47 69.81,89.47 60.66,80.33 60.66,74.47 51.18,64.99 51.18,61.73 52.51,60.41 U$1.D15 | U$1.D15
  Bottom 0.508: Q2.3 126.44,70.18 R13.2 116.47,84.35 97.02,84.35 v96.9,84.47
RS
  Top 0.508: U$1.D26 62.58,73.69 62.58,79.22 69.63,86.27 81.18,86.27 86.26,81.19 127.17,81.19 132.51,86.53 141.84,86.53 146.21,82.16 161.69,82.16 DIS1.4
RX_BLU_3V
  Bottom 0.508: JP4.2 112.39,128.89 R36.2 112.49,126.61 Q14.2
RX_BLU_5V  (via drill 0.35)
  Top 0.508: v109.99,119.04 108.89,117.94 103.44,117.94 76.31,90.81 69.76,90.81 50.37,71.42 v50.37,66.28
  Bottom 0.508: Q14.3 112.99,121.03 R37.2 111.54,119.04 v109.99,119.04 | v50.37,66.28 52.68,63.97 54.28,63.97 U$1.D16
SCL  (via drill 0.35)
  Top 0.508: v46.68,46.76 46.68,34 JP3.3 | v105.99,53.38 108.49,55.88 114.5,55.88 v114.52,55.9
  Bottom 0.508: JP3.3 46.34,30.73 43.29,27.68 30.45,27.68 23.53,34.6 23.53,49.13 43.47,69.07 58.28,69.07 59.24,68.11 59.24,66.25 U$1.D21 | v46.68,46.76 47.14,46.3 106.61,46.3 JP1.13 106.65,48.91 106.65,52.72 v105.99,53.38 | v114.52,55.9 137.58,55.9 138.06,56.38 139.51,56.38 184.49,11.4 196.52,11.4 198.1,9.82 U$2.SCL
SDA  (via drill 0.35)
  Top 0.508: JP3.2 43.97,33.83 43.97,45.49 46.17,47.69 47.53,47.69 48.03,47.19 49.57,47.19 v49.62,47.24 | v86.28,47.27 87.21,46.34 108.97,46.34 109.17,46.54 109.17,48.92 JP1.14 107.93,51.78 v111.01,54.86 | U$2.SDA 195.56,6.19 194.21,4.84 187.91,4.84 180.47,12.28 180.47,25.66 158.15,47.98 146.29,47.98 v139.05,55.22
  Bottom 0.508: U$1.D20 44.84,67.59 25.22,47.97 25.22,35.65 31.8,29.07 41.99,29.07 43.8,30.88 JP3.2 | v49.62,47.24 86.25,47.24 v86.28,47.27 | v139.05,55.22 138.69,54.86 v111.01,54.86
TX_BLU_3V
  Bottom 0.508: JP4.3 108.55,130.16 R34.2 108.73,126.56 Q13.2
TX_BLU_5V  (via drill 0.35)
  Top 0.508: v105.57,119.71 105.42,119.56 103.77,119.56 101.29,117.08 101.29,116.97 75.97,91.65 69.42,91.65 49.46,71.69 v49.46,65.37
  Bottom 0.508: Q13.3 107.03,121.91 R35.2 106.27,119.71 v105.57,119.71 | v49.46,65.37 49.46,63.46 52.14,60.78 52.9,60.78 54.32,62.2 U$1.D17